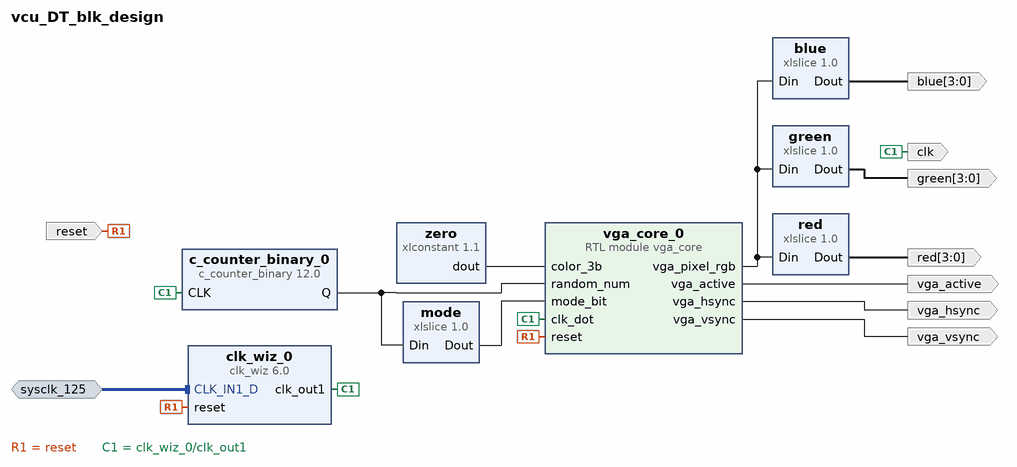
[diagram p0: block diagram of the top level]
# Vivado block design vcu_DT_blk_design, xcvu9p-flga2104-2L-e, Vivado 2019.1
create_bd_design vcu_DT_blk_design

create_bd_intf_port -mode Slave -vlnv xilinx.com:interface:diff_clock_rtl:1.0 sysclk_125
set_property -dict {CONFIG.FREQ_HZ 125000000} [get_bd_intf_ports sysclk_125]
create_bd_port -dir I -type rst reset
set_property -dict {CONFIG.POLARITY ACTIVE_HIGH} [get_bd_ports reset]
create_bd_port -dir O -from 3 -to 0 red
create_bd_port -dir O -from 3 -to 0 green
create_bd_port -dir O -from 3 -to 0 blue
create_bd_port -dir O vga_active
create_bd_port -dir O vga_hsync
create_bd_port -dir O vga_vsync
create_bd_port -dir O -type clk clk

create_bd_cell -type ip -vlnv xilinx.com:ip:xlconstant:1.1 zero
set_property -dict {CONFIG.CONST_VAL 0} [get_bd_cells zero]
create_bd_cell -type ip -vlnv xilinx.com:ip:c_counter_binary:12.0 c_counter_binary_0
set_property -dict {CONFIG.Increment_Value 3 CONFIG.Output_Width 32} [get_bd_cells c_counter_binary_0]
create_bd_cell -type ip -vlnv xilinx.com:ip:xlslice:1.0 mode
set_property -dict {CONFIG.DIN_FROM 30 CONFIG.DIN_TO 30 CONFIG.DOUT_WIDTH 1} [get_bd_cells mode]
create_bd_cell -type ip -vlnv xilinx.com:ip:xlslice:1.0 red
set_property -dict {CONFIG.DIN_FROM 23 CONFIG.DIN_TO 20 CONFIG.DIN_WIDTH 24 CONFIG.DOUT_WIDTH 4} [get_bd_cells red]
create_bd_cell -type ip -vlnv xilinx.com:ip:xlslice:1.0 green
set_property -dict {CONFIG.DIN_FROM 15 CONFIG.DIN_TO 12 CONFIG.DIN_WIDTH 24 CONFIG.DOUT_WIDTH 4} [get_bd_cells green]
create_bd_cell -type ip -vlnv xilinx.com:ip:xlslice:1.0 blue
set_property -dict {CONFIG.DIN_FROM 7 CONFIG.DIN_TO 4 CONFIG.DIN_WIDTH 24 CONFIG.DOUT_WIDTH 4} [get_bd_cells blue]
create_bd_cell -type module -reference vga_core vga_core_0
create_bd_cell -type ip -vlnv xilinx.com:ip:clk_wiz:6.0 clk_wiz_0
set_property -dict [list \
  CONFIG.CLKOUT1_JITTER 202.949 \
  CONFIG.CLKOUT1_REQUESTED_OUT_FREQ 40 \
  CONFIG.CLK_IN1_BOARD_INTERFACE sysclk_125 \
  CONFIG.MMCM_CLKOUT0_DIVIDE_F 30.000 \
  CONFIG.USE_BOARD_FLOW true \
] [get_bd_cells clk_wiz_0]

# ---- connections ----

connect_bd_intf_net -intf_net sysclk_125_1 [get_bd_intf_ports sysclk_125] [get_bd_intf_pins clk_wiz_0/CLK_IN1_D]
connect_bd_net [get_bd_pins zero/dout] [get_bd_pins vga_core_0/color_3b]
connect_bd_net [get_bd_ports reset] [get_bd_pins vga_core_0/reset] [get_bd_pins clk_wiz_0/reset]
connect_bd_net [get_bd_pins clk_wiz_0/clk_out1] [get_bd_pins c_counter_binary_0/CLK] [get_bd_ports clk] [get_bd_pins vga_core_0/clk_dot]
connect_bd_net [get_bd_pins c_counter_binary_0/Q] [get_bd_pins mode/Din] [get_bd_pins vga_core_0/random_num]
connect_bd_net -net xlslice_0_Dout [get_bd_pins mode/Dout] [get_bd_pins vga_core_0/mode_bit]
connect_bd_net [get_bd_pins vga_core_0/vga_pixel_rgb] [get_bd_pins blue/Din] [get_bd_pins green/Din] [get_bd_pins red/Din]
connect_bd_net [get_bd_pins red/Dout] [get_bd_ports red]
connect_bd_net [get_bd_pins green/Dout] [get_bd_ports green]
connect_bd_net [get_bd_pins blue/Dout] [get_bd_ports blue]
connect_bd_net [get_bd_pins vga_core_0/vga_active] [get_bd_ports vga_active]
connect_bd_net [get_bd_pins vga_core_0/vga_hsync] [get_bd_ports vga_hsync]
connect_bd_net [get_bd_pins vga_core_0/vga_vsync] [get_bd_ports vga_vsync]

validate_bd_design
save_bd_design
